# Altium schematic sheet LeftMotorControl.SchDoc
size Letter
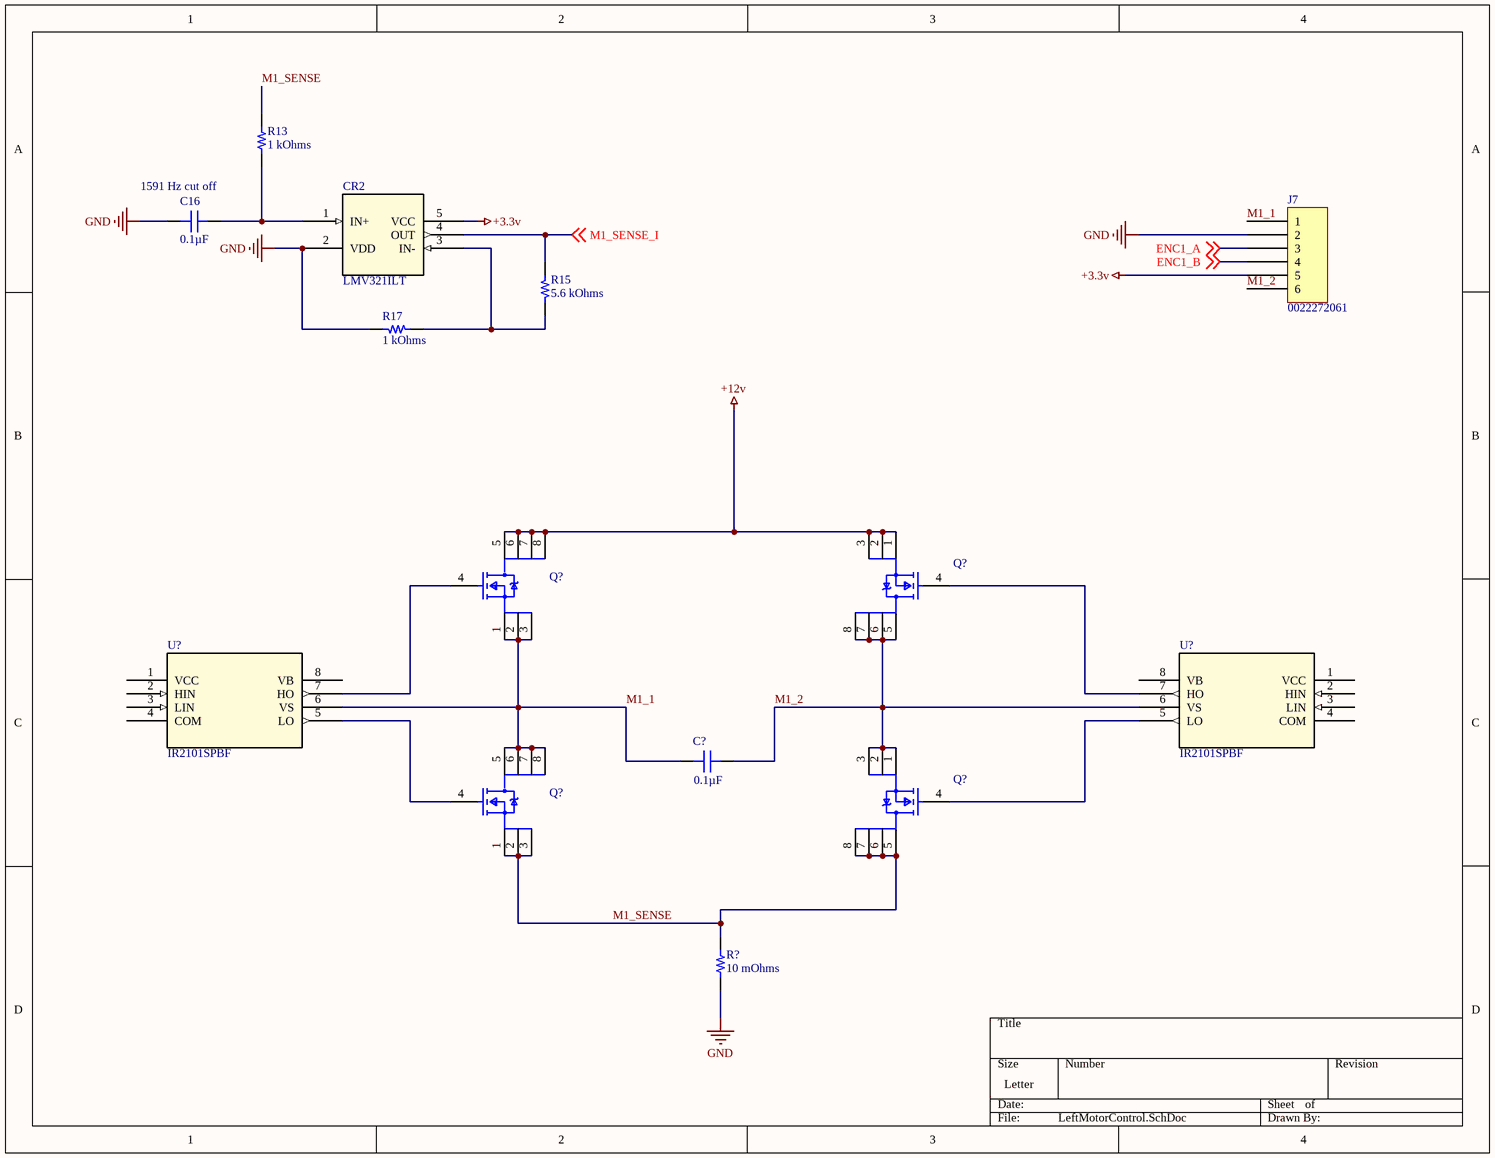
[diagram p0: LeftMotorControl.SchDoc]

## Parts
(Parts that share a designator on the sheet are numbered #1, #2 ... from top to bottom, then left to right.)
C16  0.1µF  [CAP 0805_2012]
C?  0.1µF  [CAP 0805_2012]
CR2  LMV321ILT  [SOT23-5_STM]
J7  0022272061  [MOLEX KK 0022272061]
Q?#1  IRF7821PBF  [Infineon_PG-DSO-8_MFG]  (value not drawn)
Q?#2  IRF7821PBF  [Infineon_PG-DSO-8_MFG]  (value not drawn)
Q?#3  IRF7821PBF  [Infineon_PG-DSO-8_MFG]  (value not drawn)
Q?#4  IRF7821PBF  [Infineon_PG-DSO-8_MFG]  (value not drawn)
R13  1 kOhms  [RES 0805_2012]
R15  5.6 kOhms  [RES 0805_2012]
R17  1 kOhms  [RES 0805_2012]
R?  10 mOhms  [RES 1206_3216]
U?#1  IR2101SPBF  [SO8N_INF]
U?#2  IR2101SPBF  [SO8N_INF]

## Nets
+3.3v: CR2.5(VCC) J7.5
+12v: Q?#1.5(D) Q?#1.6(D) Q?#1.7(D) Q?#1.8(D) Q?#2.1(S) Q?#2.2(S) Q?#2.3(S)
GND: C16.1 CR2.2(VDD) J7.2 R17.2 R?.2
ENC1_A: J7.3 ; off-sheet ENC1_A
ENC1_B: J7.4 ; off-sheet ENC1_B
M1_1: C?.1 J7.1 Q?#1.1(S) Q?#1.2(S) Q?#1.3(S) Q?#3.5(D) Q?#3.6(D) Q?#3.7(D) Q?#3.8(D) U?#1.6(VS)
M1_2: C?.2 J7.6 Q?#2.5(D) Q?#2.6(D) Q?#2.7(D) Q?#2.8(D) Q?#4.1(S) Q?#4.2(S) Q?#4.3(S) U?#2.6(VS)
M1_SENSE: Q?#3.1(S) Q?#3.2(S) Q?#3.3(S) Q?#4.5(D) Q?#4.6(D) Q?#4.7(D) Q?#4.8(D) R13.2 R?.1
M1_SENSE_I: CR2.4(OUT) R15.2 ; off-sheet M1_SENSE_I
NetC16_2: C16.2 CR2.1(IN+) R13.1
NetCR2_3: CR2.3(IN-) R15.1 R17.1
NetQ?#1_4: Q?#1.4(G) U?#1.7(HO)
NetQ?#2_4: Q?#2.4(G) U?#2.7(HO)
NetQ?#3_4: Q?#3.4(G) U?#1.5(LO)
NetQ?#4_4: Q?#4.4(G) U?#2.5(LO)

Not connected (* = marked no-connect by the designer): U?#1 1(VCC) 2(HIN) 3(LIN) 4(COM) 8(VB); U?#2 1(VCC) 2(HIN) 3(LIN) 4(COM) 8(VB)

## Notes on the sheet
- 1591 Hz cut off

## Library data of the parts
C16 = VJ0805V104ZXJCW1BC: CAP CER 0.1UF 16V Y5V 0805; Manufacturer: Vishay Vitramon; Temperature Coefficient: Y5V (F); Tolerance: -20%, +80%; Part Number: VJ0805V104ZXJCW1BC; Value: 0.1µF; Applications: General Purpose; Capacitance: 0.1µF; ComponentLink1Description: Datasheet; ComponentLink1URL: https://www.vishay.com/docs/28548/vjw1bcbascomseries.pdf; ComponentLink2Description: DigiKey Link; ComponentLink2URL: http://digikey.com/product-detail/en/vishay-vitramon/VJ0805V104ZXJCW1BC/720-1731-1-ND/8324151; Device Package: 0805 (2012 Metric); LastUpdated: 9/2/2020 1:04:40 AM; Lifecycle Status: Active; Minimum Order: 1; Mounting Type: Surface Mount, MLCC; Operating Temperature: -25°C ~ 85°C; Package / Case: 0805 (2012 Metric); Packaging: TapeAndReel; PartId: 3674; Part Status: Active; Price: 0.04; Series: VJ; Size / Dimension: 0.079" L x 0.049" W (2.00mm x 1.25mm); Supplier 1: DigiKey; Supplier Part Number 1: 720-1731-1-ND; Thickness (Max): 0.028" (0.70mm); Voltage - Rated: 16V
C? = AS0805KKX7R0BB104: CAP CER 0.1UF 100V X7R 0805; Manufacturer: Yageo; Tolerance: ±10%; Part Number: AS0805KKX7R0BB104; Value: 0.1µF; Applications: Automotive, Boardflex Sensitive; Capacitance: 0.1µF; ComponentLink1Description: Datasheet; ComponentLink1URL: http://www.yageo.com/NewPortal/yageodocoutput?fileName=/pdf/MLCC/UPY-AS_X7R_16V-to-630V_0.pdf; ComponentLink2Description: DigiKey Link; ComponentLink2URL: http://digikey.com/product-detail/en/yageo/AS0805KKX7R0BB104/311-4581-1-ND/8605488; Device Package: 0805 (2012 Metric); Features: Soft Termination; LastUpdated: 9/2/2020 1:04:41 AM; Lifecycle Status: Active; Minimum Order: 1; Mounting Type: Surface Mount, MLCC; Operating Temperature: -55°C ~ 125°C; Package / Case: 0805 (2012 Metric); Packaging: TapeAndReel; PartId: 2704; Part Status: Active; Price: 0.08; Ratings: AEC-Q200; Series: AS; Size / Dimension: 0.079" L x 0.049" W (2.00mm x 1.25mm); Supplier 1: DigiKey; Supplier Part Number 1: 311-4581-1-ND; Temperature Coefficient: X7R; Thickness (Max): 0.057" (1.45mm); Voltage - Rated: 100V
CR2 = LMV321ILT: No Description Available; SourceLibrary: Update_to_database_2020-12-04; Built_By: EMA_UL_Team; Vendor: STMicroelectronics; Type: DEV; Manufacturer_Part_Number: LMV321ILT; Copyright: Copyright (C) 2018 Accelerated Designs. All rights reserved; RefDes: RefDes
J7 = 0022272061: CONN HEADER VERT 6POS 2.54MM; Manufacturer: Molex; Contact Length - Mating: 0.295" (7.49mm); Contact Length - Post: 0.140" (3.56mm); Material Flammability Rating: UL94 V-0; Number of Positions: 6; Number of Positions Loaded: All; Overall Contact Length: 0.560" (14.22mm); Pitch - Mating: 0.100" (2.54mm); Shrouding: Shrouded - 1 Wall; Style: Board to Cable/Wire; Part Number: 0022272061; ComponentLink1Description: Datasheet; ComponentLink1URL: https://www.molex.com/pdm_docs/sd/022272061_sd.pdf; ComponentLink2Description: DigiKey Link; ComponentLink2URL: http://digikey.com/product-detail/en/molex/0022272061/WM4115-ND/1130581; Connector Type: Header; Contact Finish - Mating: Tin; Contact Finish - Post: Tin; Contact Finish Thickness - Mating: 100.0µin (2.54µm); Contact Material: Brass; Contact Shape: Square; Contact Type: Male Pin; Fastening Type: Friction Lock; Insulation Color: Natural; Insulation Height: 0.461" (11.70mm); Insulation Material: Polyamide (PA), Nylon; LastUpdated: 1/12/2020 11:52:24 PM; Lifecycle Status: Active; Minimum Order: 1; Mounting Type: Through Hole; Number of Rows: 1; Packaging: Bulk; PartId: 80; Part Status: Active; Price: 0.49; Series: KK 6410; Supplier 1: DigiKey; Supplier Part Number 1: WM4115-ND; Termination: Solder
Q?#1-Q?#4 = IRF7821PBF: N-Channel 30V 13.6A (Ta) 2.5W (Ta) Surface Mount 8-SO; Manufacturer: Infineon; Obsolete Part: true; Depletion Mode: False; Drain To Source Resistance: 9.5mΩ; Gate Charge At Vgs: 9.3nC @ 4.5V; Gate To Source Voltage: 20V; Input Capacitace At Vds: 1010pF @ 15V; Max Forward Diode Voltage: 1V; Max Junction Temp: +155°C; Number Of Channels: 1; Pulse Drain Current: 100A; Reverse Recovery Charge: 23nC; Reverse Recovery Time: 28ns; Rthja Max: 50°C/W; Standoff Height: 0.1mm; Symbol Hash: 3d3f0ff5b7ae070eb07a165ed51af52cc164f16ed04de7c10a0bfba51cf38c76; Turn Off Delay Time: 9.7ns; Turn On Delay Time: 6.3ns; Verification Version: 0.0.0.3; Datasheet Path: datasheets/Trans_Infineon_IRF7821PBF_eec.pdf; Automotive: No; ComponentLink1Description: Upverter; ComponentLink1URL: https://upverter.com/part/id/49b82e331fdb8a27/; ComponentLink2Description: Datasheet; ComponentLink2URL: https://www.infineon.com/dgdl/irf7821pbf.pdf?fileId=5546d462533600a401535608d7f31d06; Continuous Drain Current: 13.6A; Digikey Description: MOSFET N-CH 30V 13.6A 8-SOIC; Digikey Part Number: IRF7821PBF-ND; Drain To Source Breakdown Voltage: 30V; Drain To Source Voltage: 30V; Footprint Url: https://www.infineon.com/cms/en/product/packages/PG-DSO/PG-DSO-8-902/; Height: 1.75mm; Lead Free: Yes; Mouser Description: In a Pack of 5, IRF7821PBF N-Channel MOSFET, 13.6 A, 30 V HEXFET, 8-Pin SOIC Infineon; Mouser Part Number: 942-IRF7821PBF; Number Of N Channels: 1; Package: PG-DSO-8; Part Number: IRF7821PBF; Power Dissipation: 2.5W; RoHS: TRUE; Supplier 1: Digi-Key; Supplier 2: Mouser; Supplier Part Number 1: IRF7821PBF-ND; Supplier Part Number 2: 942-IRF7821PBF; Temperature: -55°C to +155°C; Temperature Range High: +155°C; Temperature Range Low: -55°C; Threshold Vgs Min: 1V; helpURL: https://upverter.com/part/id/49b82e331fdb8a27/
R13 = RN73R2ATTD1001F50: RES 1K OHM 1% 1/8W 0805; Manufacturer: KOA Speer Electronics, Inc.; Power (Watts): 0.125W, 1/8W; Temperature Coefficient: ±50ppm/°C; Part Number: RN73R2ATTD1001F50; Value: 1 kOhms; ComponentLink1Description: Datasheet; ComponentLink1URL: //media.digikey.com/pdf/Data%20Sheets/KOA%20Speer/RN73R_Type_DS.pdf; ComponentLink2Description: DigiKey Link; ComponentLink2URL: http://digikey.com/product-detail/en/koa-speer-electronics-inc/RN73R2ATTD1001F50/2019-RN73R2ATTD1001F50CT-ND/11476952; Composition: Metal Film; Device Package: 0805 (2012 Metric); Features: Moisture Resistant; LastUpdated: 9/2/2020 1:14:23 AM; Lifecycle Status: Active; Minimum Order: 1; Number of Terminations: 2; Operating Temperature: -55°C ~ 155°C; Package / Case: 0805 (2012 Metric); Packaging: TapeAndReel; PartId: 50101; Part Status: Active; Price: 0.06; Resistance: 1 kOhms; Series: RN73R; Supplier 1: DigiKey; Supplier Part Number 1: 2019-RN73R2ATTD1001F50CT-ND; Supplier Device Package: 0805; Tolerance: ±1%
R15 = ERJ-6ENF5601V: RES SMD 5.6K OHM 1% 1/8W 0805; Manufacturer: Panasonic Electronic Components; Power (Watts): 0.125W, 1/8W; Temperature Coefficient: ±100ppm/°C; Part Number: ERJ-6ENF5601V; Value: 5.6 kOhms; ComponentLink1Description: Datasheet; ComponentLink1URL: https://industrial.panasonic.com/cdbs/www-data/pdf/RDA0000/AOA0000C304.pdf; ComponentLink2Description: DigiKey Link; ComponentLink2URL: http://digikey.com/product-detail/en/panasonic-electronic-components/ERJ-6ENF5601V/P5.60KCCT-ND/1746882; Composition: Thick Film; Device Package: 0805 (2012 Metric); Features: Automotive AEC-Q200; Height - Seated (Max): 0.028" (0.70mm); LastUpdated: 9/2/2020 1:15:09 AM; Lifecycle Status: Active; Minimum Order: 1; Number of Terminations: 2; Operating Temperature: -55°C ~ 155°C; Package / Case: 0805 (2012 Metric); Packaging: TapeAndReel; PartId: 34762; Part Status: Active; Price: 0.01; Ratings: AEC-Q200; Resistance: 5.6 kOhms; Series: ERJ; Size / Dimension: 0.079" L x 0.049" W (2.00mm x 1.25mm); Supplier 1: DigiKey; Supplier Part Number 1: P5.60KCCT-ND; Supplier Device Package: 0805; Tolerance: ±1%
R17 = CRCW08051K00FKEA: RES SMD 1K OHM 1% 1/8W 0805; Manufacturer: Vishay Dale; Power (Watts): 0.125W, 1/8W; Temperature Coefficient: ±100ppm/°C; Part Number: CRCW08051K00FKEA; Value: 1 kOhms; ComponentLink1Description: Datasheet; ComponentLink1URL: http://www.vishay.com/docs/20035/dcrcwe3.pdf; ComponentLink2Description: DigiKey Link; ComponentLink2URL: http://digikey.com/product-detail/en/vishay-dale/CRCW08051K00FKEA/541-1.00KCCT-ND/1180783; Composition: Thick Film; Device Package: 0805 (2012 Metric); Features: Automotive AEC-Q200; Height - Seated (Max): 0.020" (0.50mm); LastUpdated: 9/2/2020 1:15:23 AM; Lifecycle Status: Active; Minimum Order: 1; Number of Terminations: 2; Operating Temperature: -55°C ~ 155°C; Package / Case: 0805 (2012 Metric); Packaging: TapeAndReel; PartId: 28103; Part Status: Active; Price: 0.01; Ratings: AEC-Q200; Resistance: 1 kOhms; Series: CRCW; Size / Dimension: 0.079" L x 0.049" W (2.00mm x 1.25mm); Supplier 1: DigiKey; Supplier Part Number 1: 541-1.00KCCT-ND; Supplier Device Package: 0805; Tolerance: ±1%
R? = LVT12R0100FER: RES 0.01 OHM 1% 1W 1206; Manufacturer: Ohmite; Temperature Coefficient: ±75ppm/°C; Part Number: LVT12R0100FER; ComponentLink1Description: Datasheet; ComponentLink1URL: https://www.ohmite.com/assets/docs/res_lvt.pdf?r=false; ComponentLink2Description: DigiKey Link; ComponentLink2URL: http://digikey.com/product-detail/en/ohmite/LVT12R0100FER/LVT12R0100FERCT-ND/9556182; Composition: Metal Element; Device Package: 1206 (3216 Metric); Features: Current Sense; Height - Seated (Max): 0.026" (0.65mm); LastUpdated: 9/2/2020 1:12:33 AM; Lifecycle Status: Active; Minimum Order: 1; Number of Terminations: 2; Operating Temperature: -55°C ~ 155°C; Package / Case: 1206 (3216 Metric); Packaging: TapeAndReel; PartId: 42343; Part Status: Active; Power (Watts): 1W; Price: 0.07; Resistance: 10 mOhms; Series: LVT; Size / Dimension: 0.126" L x 0.063" W (3.20mm x 1.60mm); Supplier 1: DigiKey; Supplier Part Number 1: LVT12R0100FERCT-ND; Supplier Device Package: 1206; Tolerance: ±1%; Value: 10 mOhms
U?#1 U?#2 = IR2101SPBF: No Description Available; Mfr_Name: Infineon; Copyright: Copyright (C) 2021 Ultra Librarian. All rights reserved.; Manufacturer_Part_Number: IR2101SPBF; RefDes: RefDes; Type: DEV